# Altium schematic sheet PROB_S7CAS_FLASH.SchDoc
size Tabloid; SheetNumber: 9; SheetTotal: 10; Sheet_Name: Insert name in Document Parameters; Size: 11x17
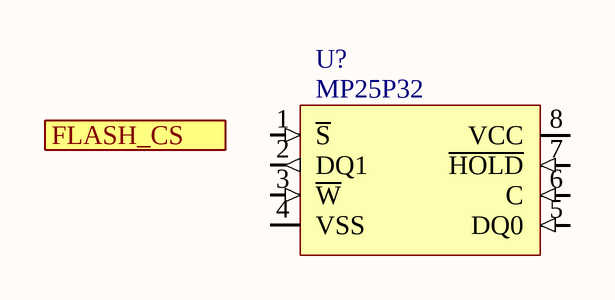
[diagram p0: PROB_S7CAS_FLASH.SchDoc]

## Parts
U?  MP25P32

## Ports
FLASH_CS

## Nets

Not connected (* = marked no-connect by the designer): U? 1(~{S}) 2(DQ1) 3(~{W}) 4(VSS) 5(DQ0) 6(C) 7(~{HOLD}) 8(VCC)

## Notes on the sheet
- Sheet Name
- Project Title
- Global Project
- Size
- Group
- Revision
- Date
- Sheet
- of
- Filename
- Designers

## Library data of the parts
U? = M25P32 32Mb 3V NOR Serial Flash: MP25P32 - 32Mb (4Mb x 8) serial Flash memory device - VFQFPN8 (6X5); GRAMS Lib Spec: 2.7